# Altium project Battery Protector.PrjPcb
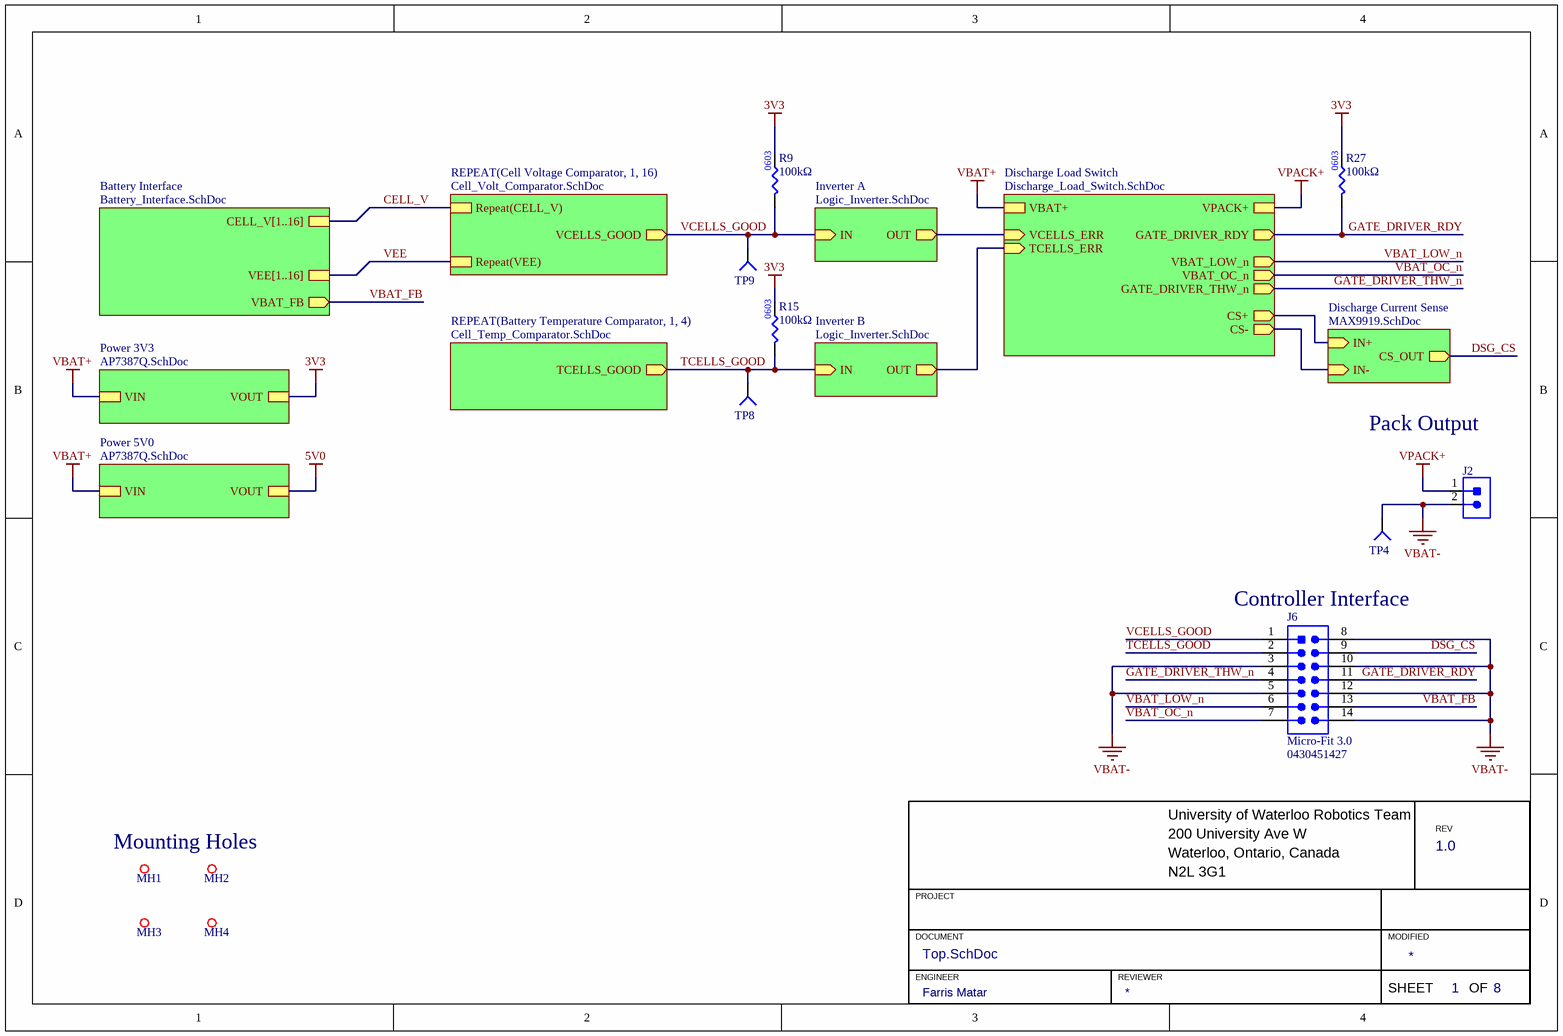
[diagram p0: Top.SchDoc]
Revision: 1.0; Engineer: Farris Matar
8 sheets, 434 parts. Net scope: hierarchical (ports join the sheet entries above them; power ports are global).
Board file: Battery Protector.PcbDoc
Sheets:
  Top.SchDoc
    Cell Voltage Comparator1 = Cell_Volt_Comparator.SchDoc
    Cell Voltage Comparator2 = Cell_Volt_Comparator.SchDoc
    Cell Voltage Comparator3 = Cell_Volt_Comparator.SchDoc
    Cell Voltage Comparator4 = Cell_Volt_Comparator.SchDoc
    Cell Voltage Comparator5 = Cell_Volt_Comparator.SchDoc
    Cell Voltage Comparator6 = Cell_Volt_Comparator.SchDoc
    Cell Voltage Comparator7 = Cell_Volt_Comparator.SchDoc
    Cell Voltage Comparator8 = Cell_Volt_Comparator.SchDoc
    Cell Voltage Comparator9 = Cell_Volt_Comparator.SchDoc
    Cell Voltage Comparator10 = Cell_Volt_Comparator.SchDoc
    Cell Voltage Comparator11 = Cell_Volt_Comparator.SchDoc
    Cell Voltage Comparator12 = Cell_Volt_Comparator.SchDoc
    Cell Voltage Comparator13 = Cell_Volt_Comparator.SchDoc
    Cell Voltage Comparator14 = Cell_Volt_Comparator.SchDoc
    Cell Voltage Comparator15 = Cell_Volt_Comparator.SchDoc
    Cell Voltage Comparator16 = Cell_Volt_Comparator.SchDoc
    Battery Interface = Battery_Interface.SchDoc
    Battery Temperature Comparator1 = Cell_Temp_Comparator.SchDoc
    Battery Temperature Comparator2 = Cell_Temp_Comparator.SchDoc
    Battery Temperature Comparator3 = Cell_Temp_Comparator.SchDoc
    Battery Temperature Comparator4 = Cell_Temp_Comparator.SchDoc
    Power 3V3 = AP7387Q.SchDoc
    Discharge Load Switch = Discharge_Load_Switch.SchDoc
    Inverter B = Logic_Inverter.SchDoc
    Inverter A = Logic_Inverter.SchDoc
    Discharge Current Sense = MAX9919.SchDoc
    Power 5V0 = AP7387Q.SchDoc

## Sheet Top.SchDoc
size A4; Engineer: Farris Matar; Organization: TESLA Motors, INC; Address1: 3500 Deer Creek Road; Address2: Palo Alto, CA; Address4: U.S.A.; SheetNumber: 1; SheetTotal: 8

### Parts
J2  CON_2POS_XT90  [XT90]  (value not drawn)
J6  Family: Micro-Fit 3.0  [MOLEX-0430451427]  (hidden comment: 0430451427)
MH1  MOUNTING_HOLE_M3  [MOUNTING_HOLE_3mm]  (value not drawn)  (no BOM)
MH2  MOUNTING_HOLE_M3  [MOUNTING_HOLE_3mm]  (value not drawn)  (no BOM)
MH3  MOUNTING_HOLE_M3  [MOUNTING_HOLE_3mm]  (value not drawn)  (no BOM)
MH4  MOUNTING_HOLE_M3  [MOUNTING_HOLE_3mm]  (value not drawn)  (no BOM)
R9  value 100kΩ  [RES0603]  (hidden comment: RES_100kΩ_0603_1%)
R15  value 100kΩ  [RES0603]  (hidden comment: RES_100kΩ_0603_1%)
R27  value 100kΩ  [RES0603]  (hidden comment: RES_100kΩ_0603_1%)
TP4  TESTPOINT_SMD_LOOP  [S1751-46R]  (value not drawn)
TP8  TESTPOINT_1MM_CIRCLE  [TESTPOINT_CIRCLE_1MM]  (value not drawn)  (no BOM)
TP9  TESTPOINT_1MM_CIRCLE  [TESTPOINT_CIRCLE_1MM]  (value not drawn)  (no BOM)

### Sub-sheets
Battery Interface = Battery_Interface.SchDoc: CELL_V[1..16], VEE[1..16], VBAT_FB (out)
Discharge Current Sense = MAX9919.SchDoc: IN+ (in), IN- (in), CS_OUT (out)
Discharge Load Switch = Discharge_Load_Switch.SchDoc: VBAT+, VPACK+, VCELLS_ERR (in), TCELLS_ERR (in), VBAT_LOW_n (out), VBAT_OC_n (out), GATE_DRIVER_THW_n (out), GATE_DRIVER_RDY (out), CS+ (out), CS- (out)
Inverter A = Logic_Inverter.SchDoc: IN (in), OUT (out)
Inverter B = Logic_Inverter.SchDoc: IN (in), OUT (out)
Power 3V3 = AP7387Q.SchDoc: VIN, VOUT
Power 5V0 = AP7387Q.SchDoc: VIN, VOUT
REPEAT(Battery Temperature Comparator, 1, 4) = Cell_Temp_Comparator.SchDoc: TCELLS_GOOD (out)
REPEAT(Cell Voltage Comparator, 1, 16) = Cell_Volt_Comparator.SchDoc: Repeat(CELL_V), Repeat(VEE), VCELLS_GOOD (out)

### Nets
3V3: R9.2 R15.2 R27.2 ; sheet Power 3V3/VOUT
VBAT+: sheet Power 3V3/VIN, sheet Discharge Load Switch/VBAT+, sheet Discharge Load Switch/CS+, sheet Discharge Current Sense/IN+, sheet Power 5V0/VIN
VBAT-: J2.2 J6.3 J6.5 J6.8 J6.10 J6.12 J6.14 TP4.1(=value)
VPACK+: J2.1 ; sheet Discharge Load Switch/VPACK+
CELL_V: sheet REPEAT(Cell Voltage Comparator, 1, 16)/Repeat(CELL_V)
CS-: sheet Discharge Load Switch/CS-, sheet Discharge Current Sense/IN-
DSG_CS: J6.9 ; sheet Discharge Current Sense/CS_OUT
GATE_DRIVER_RDY: J6.11 R27.1 ; sheet Discharge Load Switch/GATE_DRIVER_RDY
GATE_DRIVER_THW_n: J6.4 ; sheet Discharge Load Switch/GATE_DRIVER_THW_n
TCELLS_ERR: sheet Discharge Load Switch/TCELLS_ERR, sheet Inverter B/OUT
TCELLS_GOOD: J6.2 R15.1 TP8.1(=value) ; sheet REPEAT(Battery Temperature Comparator, 1, 4)/TCELLS_GOOD, sheet Inverter B/IN  [project net CT_GD]
VBAT_FB: J6.13 ; sheet Battery Interface/VBAT_FB
VBAT_LOW_n: J6.6 ; sheet Discharge Load Switch/VBAT_LOW_n
VBAT_OC_n: J6.7 ; sheet Discharge Load Switch/VBAT_OC_n
VCELLS_ERR: sheet Discharge Load Switch/VCELLS_ERR, sheet Inverter A/OUT
VCELLS_GOOD: J6.1 R9.1 TP9.1(=value) ; sheet REPEAT(Cell Voltage Comparator, 1, 16)/VCELLS_GOOD, sheet Inverter A/IN
VEE: sheet REPEAT(Cell Voltage Comparator, 1, 16)/Repeat(VEE)

### Notes on the sheet
- Pack Output
- (near J6) Controller Interface
- Mounting Holes
- University of Waterloo Robotics Team
- 200 University Ave W
- REV
- PROJECT
- Waterloo, Ontario, Canada
- N2L 3G1
- DOCUMENT
- ENGINEER
- REVIEWER
- MODIFIED
- SHEET
- OF
- (in symbol RES_100kΩ_0603_1%) 0603

### Library data of the parts
J2 = CON_2POS_XT90: HIGH QUALITY GOLD PLATED XT90 MA; Manufacturer 1: DFRobot; Manufacturer Part Number 1: FIT0588; Mounting Type: TH; Package/Footprint: XT90; Supplier 1: Digi-Key; Supplier Part Number 1: 1738-1438-ND
J6 = CON_MOLEX-HDR_7x2_TH: CONN HEADER VERT 14POS 3MM; Manufacturer 1: Molex; Voltage Rating: 250VAC; Current Rating: 5A; Pitch: 3mm; Supplier 1: Digi-Key; Supplier Part Number 1: WM10707-ND; Manufacturer Part Number 1: 0430451427
R9 R15 R27 = RES_100kΩ_0603_1%: RES 100K OHM 1% 1/10W 0603; Manufacturer 1: Yageo; Manufacturer Part Number 1: RC0603FR-07100KL; Supplier Part Number 1: 311-100KHRCT-ND; Supplier 1: Digi-Key
TP4 = TESTPOINT_SMD_LOOP: TESTPOINT SMD LOOP; Manufacturer 1: Harwin; Supplier 1: Digi-Key; Manufacturer Part Number 1: S1751-46R; Mounting Type: SMD; Package/Footprint: SMD; Supplier Part Number 1: 952-1478-1-ND
TP8 TP9 = TESTPOINT_1MM_CIRCLE: TESTPOINT 1MM CIRCLE

## Sheet Cell_Volt_Comparator.SchDoc
size A4; Engineer: Farris Matar; Organization: TESLA Motors, INC; Address1: 3500 Deer Creek Road; Address2: Palo Alto, CA; Address4: U.S.A.; SheetNumber: 4; SheetTotal: 8
Used 16 times, as channels Cell Voltage Comparator1, Cell Voltage Comparator2, Cell Voltage Comparator3, Cell Voltage Comparator4, Cell Voltage Comparator5, Cell Voltage Comparator6, Cell Voltage Comparator7, Cell Voltage Comparator8, Cell Voltage Comparator9, Cell Voltage Comparator10, Cell Voltage Comparator11, Cell Voltage Comparator12, Cell Voltage Comparator13, Cell Voltage Comparator14, Cell Voltage Comparator15, Cell Voltage Comparator16. Parts and nets are listed once, with the designators drawn on the sheet.
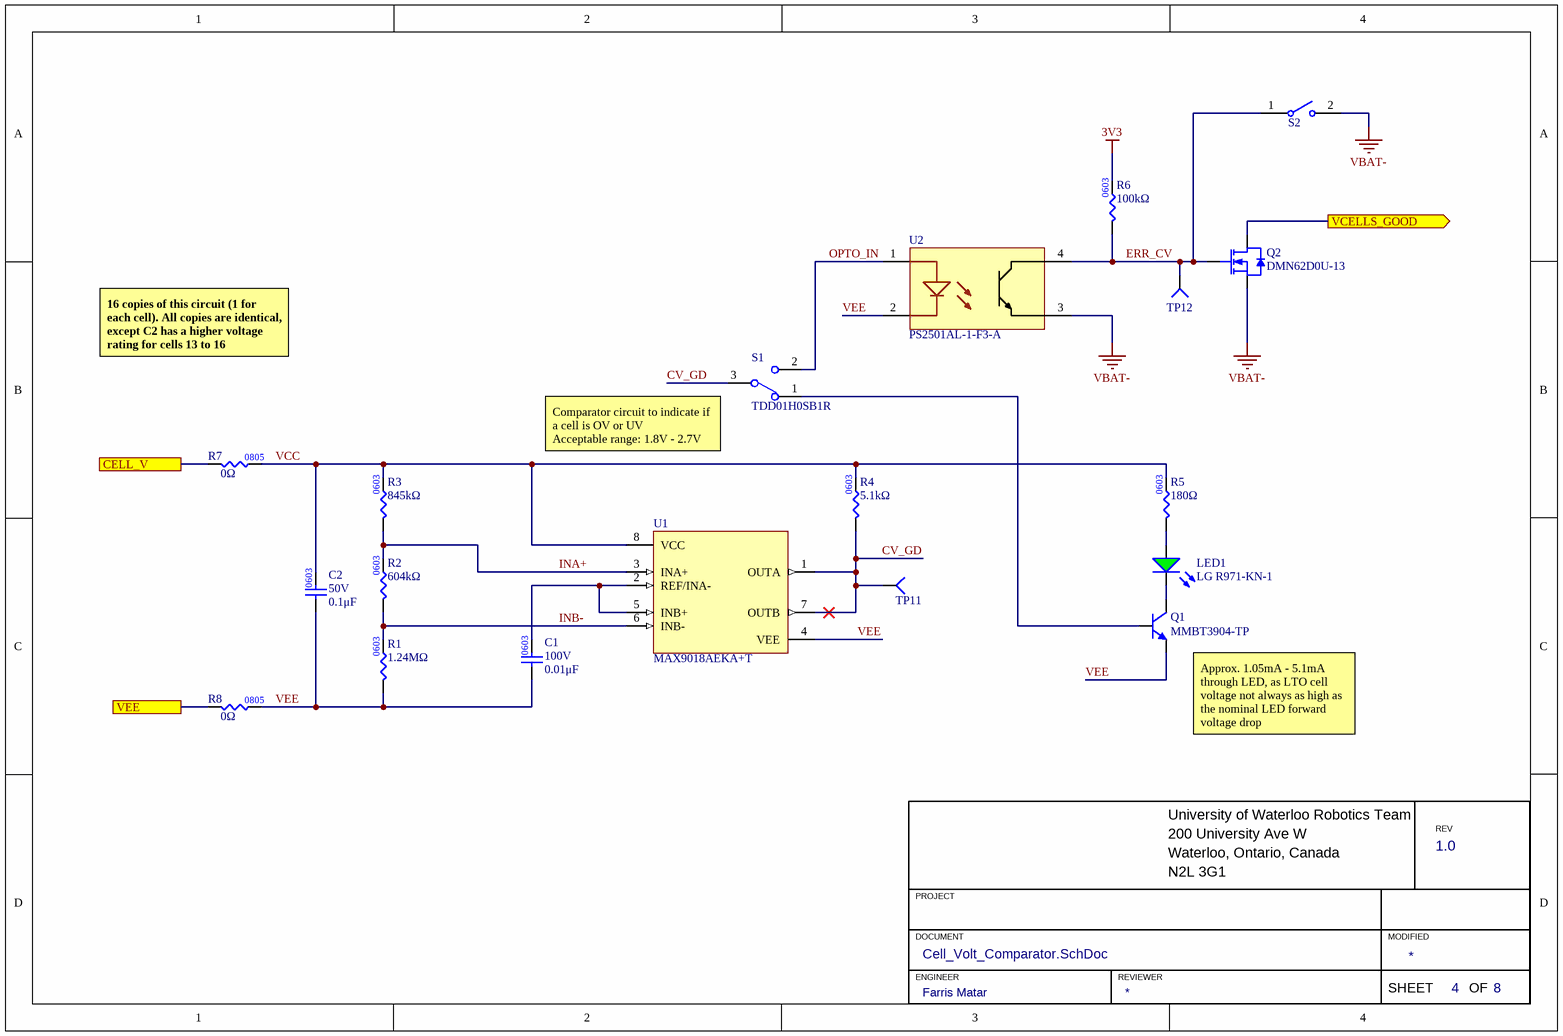
[diagram p1: Cell_Volt_Comparator.SchDoc]

### Parts
C1  value 0.01μF  Voltage Rating: 100V  [CAP0603]  (hidden comment: CAP_0.01uF_100V_0603)
C2  value 0.1μF  Voltage Rating: 50V  [CAP0603]  (hidden comment: CAP_0.1uF_50V_0603)
LED1  Manufacturer Part Number 1: LG R971-KN-1  [LED_0805_GREEN]  (hidden comment: LED_GREEN)
Q1  Manufacturer Part Number 1: MMBT3904-TP  [SOT23-3]  (hidden comment: NPN_40V_100mA)
Q2  Manufacturer Part Number 1: DMN62D0U-13  [NMOS_SSOT-3]  (hidden comment: NMOS_60V_380mA)
R1  value 1.24MΩ  [RES0603]  (hidden comment: RES_1.24MΩ_0603_1%)
R2  value 604kΩ  [RES0603]  (hidden comment: RES_604kΩ_0603_1%)
R3  value 845kΩ  [RES0603]  (hidden comment: RES_845kΩ_0603_1%)
R4  value 5.1kΩ  [RES0603]  (hidden comment: RES_5.1kΩ_0603_1%)
R5  value 180Ω  [RES0603]  (hidden comment: RES_180Ω_0603_1%)
R6  value 100kΩ  [RES0603]  (hidden comment: RES_100kΩ_0603_1%)
R7  value 0Ω  [RES0805]  (hidden comment: RES_0Ω_0805)
R8  value 0Ω  [RES0805]  (hidden comment: RES_0Ω_0805)
S1  Manufacturer Part Number 1: TDD01H0SB1R  [TDD01_SPDT]  (hidden comment: SW_SLIDE_SPDT_SMD)
S2  SW_SLIDE_SPST_SMD  [SDA01_SPST]  (value not drawn)
TP11  TESTPOINT_1MM_CIRCLE  [TESTPOINT_CIRCLE_1MM]  (value not drawn)  (no BOM)
TP12  TESTPOINT_1MM_CIRCLE  [TESTPOINT_CIRCLE_1MM]  (value not drawn)  (no BOM)
U1  Manufacturer Part Number 1: MAX9018AEKA+T  [SOT23-8 MAXIM]  (hidden comment: IC_COMPARATOR_MAX9018)
U2  Manufacturer Part Number 1: PS2501AL-1-F3-A  [DIP-4L_REN]  (hidden comment: OPTOCOUPLER_PS2501AL-1-F3-A)

### Ports
CELL_V, VCELLS_GOOD (out), VEE

### Nets
3V3: R6.2
VBAT-: Q2.2(SOURCE) S2.2 U2.3(Emitter)
CELL_V: R7.1 ; port CELL_V
CV_GD: R4.1 S1.3 TP11.1(=value) U1.1(OUTA) U1.7(OUTB)
ERR_CV: Q2.1(GATE) R6.1 S2.1 TP12.1(=value) U2.4(Collector)
INA+: R2.2 R3.1 U1.3(INA+)
INB-: R1.2 R2.1 U1.6(INB-)
OPTO_IN: S1.2 U2.1(Anode)
VCC: C2.2 R3.2 R4.2 R5.2 R7.2 U1.8(VCC)
VCELLS_GOOD: Q2.3(DRAIN) ; port VCELLS_GOOD
VEE: C1.1 C2.1 Q1.2(E) R1.1 R8.2 U1.4(VEE) U2.2(Cathode)
VEE: R8.1 ; port VEE  [a separate net that carries the same name]
NetC1_2: C1.2 U1.2(REF/INA-) U1.5(INB+)
NetLED1_1: LED1.1(A) R5.1
NetLED1_2: LED1.2(K) Q1.3(C)
NetQ1_1: Q1.1(B) S1.1

### Channels
Cell Voltage Comparator1: designators end in A; ports CELL_V=CELL_V1 VCELLS_GOOD=VCELLS_GOOD VEE=VEE1
Cell Voltage Comparator2: designators end in B; ports CELL_V=CELL_V2 VCELLS_GOOD=VCELLS_GOOD VEE=VEE2
Cell Voltage Comparator3: designators end in C; ports CELL_V=CELL_V3 VCELLS_GOOD=VCELLS_GOOD VEE=VEE3
Cell Voltage Comparator4: designators end in D; ports CELL_V=CELL_V4 VCELLS_GOOD=VCELLS_GOOD VEE=VEE4
Cell Voltage Comparator5: designators end in E; ports CELL_V=CELL_V5 VCELLS_GOOD=VCELLS_GOOD VEE=VEE5
Cell Voltage Comparator6: designators end in F; ports CELL_V=CELL_V6 VCELLS_GOOD=VCELLS_GOOD VEE=VEE6
Cell Voltage Comparator7: designators end in G; ports CELL_V=CELL_V7 VCELLS_GOOD=VCELLS_GOOD VEE=VEE7
Cell Voltage Comparator8: designators end in H; ports CELL_V=CELL_V8 VCELLS_GOOD=VCELLS_GOOD VEE=VEE8
Cell Voltage Comparator9: designators end in I; ports CELL_V=CELL_V9 VCELLS_GOOD=VCELLS_GOOD VEE=VEE9
Cell Voltage Comparator10: designators end in J; ports CELL_V=CELL_V10 VCELLS_GOOD=VCELLS_GOOD VEE=VEE10
Cell Voltage Comparator11: designators end in K; ports CELL_V=CELL_V11 VCELLS_GOOD=VCELLS_GOOD VEE=VEE11
Cell Voltage Comparator12: designators end in L; ports CELL_V=CELL_V12 VCELLS_GOOD=VCELLS_GOOD VEE=VEE12
Cell Voltage Comparator13: designators end in M; ports CELL_V=CELL_V13 VCELLS_GOOD=VCELLS_GOOD VEE=VEE13
Cell Voltage Comparator14: designators end in N; ports CELL_V=CELL_V14 VCELLS_GOOD=VCELLS_GOOD VEE=VEE14
Cell Voltage Comparator15: designators end in O; ports CELL_V=CELL_V15 VCELLS_GOOD=VCELLS_GOOD VEE=VEE15
Cell Voltage Comparator16: designators end in P; ports CELL_V=CELL_V16 VCELLS_GOOD=VCELLS_GOOD VEE=VEE16

### Notes on the sheet
- 16 copies of this circuit (1 for each cell). All copies are identical, except C2 has a higher voltage rating for cells 13 to 16
- (near S1) Comparator circuit to indicate if a cell is OV or UV
  Acceptable range: 1.8V - 2.7V
- (near Q1) Approx. 1.05mA - 5.1mA through LED, as LTO cell voltage not always as high as the nominal LED forward voltage drop
- University of Waterloo Robotics Team
- 200 University Ave W
- REV
- PROJECT
- Waterloo, Ontario, Canada
- N2L 3G1
- DOCUMENT
- ENGINEER
- REVIEWER
- MODIFIED
- SHEET
- OF
- (in symbol CAP_0.01uF_100V_0603) 0603
- (in symbol RES_100kΩ_0603_1%) 0603
- (in symbol RES_180Ω_0603_1%) 0603
- (in symbol RES_604kΩ_0603_1%) 0603
- (in symbol RES_845kΩ_0603_1%) 0603

### Library data of the parts
C1 = CAP_0.01uF_100V_0603: CAP CER 0.01uF 100V X7R 0603; Manufacturer Part Number 1: GCM188R72A103KA37J; Manufacturer 1: Murata Electronics; Supplier Part Number 1: 490-8028-1-ND; Supplier 1: Digi-Key; Dielectric: X7R
C2 = CAP_0.1uF_50V_0603: CAP CER 0.1UF 50V X7R 0603; Manufacturer Part Number 1: CC0603KRX7R9BB104; Manufacturer 1: Yageo; Package/Footprint: 0603; Supplier Part Number 1: 311-1344-1-ND; Supplier 1: Digi-Key; Mounting Type: SMD; Dielectric: X7R
LED1 = LED_GREEN: LED GREEN DIFFUSED 0805 SMD; Manufacturer 1: OSRAM; Forward Voltage Drop: 2.2V; Package/Footprint: 0805; Supplier Part Number 1: 475-1410-1-ND; Supplier 1: Digi-Key; Mounting Type: SMD
Q1 = NPN_40V_100mA: TRANS NPN 40V 0.2A SOT23; Manufacturer 1: Micro Commercial Co; Package: SOT-23-3; Supplier Part Number 1: MMBT3904TPMSCT-ND; Supplier 1: Digi-Key
Q2 = NMOS_60V_380mA: MOSFET N-CH 60V 380MA SOT23; Manufacturer 1: Diodes Incorporated; Vgs (Max): ±12V; Supplier 1: Digi-Key; Mounting Type: SMD; Package: SOT-23-3; Supplier Part Number 1: DMN62D0U-13DICT-ND; Id: 380mA; Vdss: 60V
R1 = RES_1.24MΩ_0603_1%: RES 1.24M OHM 1% 1/16W 0402; Manufacturer 1: Stackpole Electronics Inc; Manufacturer Part Number 1: RMCF0402FT1M24; Package: 0603; Supplier 1: Digi-Key; Supplier Part Number 1: RMCF0402FT1M24CT-ND
R2 = RES_604kΩ_0603_1%: RES 604K OHM 1% 1/10W 0603; Manufacturer 1: Yageo; Manufacturer Part Number 1: RC0603FR-07604KL; Supplier Part Number 1: 311-604KHRCT-ND; Supplier 1: Digi-Key
R3 = RES_845kΩ_0603_1%: RES 845K OHM 1% 1/10W 0603; Manufacturer 1: Yageo; Manufacturer Part Number 1: RC0603FR-07845KL; Supplier Part Number 1: 311-845KHRCT-ND; Supplier 1: Digi-Key
R4 = RES_5.1kΩ_0603_1%: RES 5.1K OHM 1% 1/10W 0603; Manufacturer 1: YAGEO; Manufacturer Part Number 1: RC0603FR-135K1L; Supplier Part Number 1: 13-RC0603FR-135K1LCT-ND; Supplier 1: Digi-Key; Mounting Type: SMD; Package: 0603
R5 = RES_180Ω_0603_1%: RES 180 OHM 1% 1/10W 0603; Manufacturer 1: Yageo; Manufacturer Part Number 1: RC0603FR-13180RL; Supplier Part Number 1: 13-RC0603FR-13180RLCT-ND; Supplier 1: Digi-Key
R6 = RES_100kΩ_0603_1%: as R9 on sheet Top; Supplier Part Number 1: 311-100KHRCT-ND; Supplier 1: Digi-Key
R7 R8 = RES_0Ω_0805: RES SMD 0 OHM JUMPER 1/2W 0805 (20A RATED); Manufacturer 1: Keystone Electronics; Manufacturer Part Number 1: 5106; Package/Footprint: 0805; Supplier Part Number 1: 36-5106CT-ND; Supplier 1: Digi-Key; Mounting Type: SMD
S1 = SW_SLIDE_SPDT_SMD: SWITCH SLIDE DIP SPDT 25MA 24V; Manufacturer 1: C&K; Voltage Rating: 24VDC; Supplier 1: Digi-Key; Supplier Part Number 1: CKN10546CT-ND
S2 = SW_SLIDE_SPST_SMD: SWITCH SLIDE DIP SPST 25MA 24V; Manufacturer 1: C&K; Manufacturer Part Number 1: SDA01H0SB; Voltage Rating: 24VDC; Supplier 1: Digi-Key; Supplier Part Number 1: CKN10914-ND
TP11 TP12 = TESTPOINT_1MM_CIRCLE: TESTPOINT 1MM CIRCLE
U1 = IC_COMPARATOR_MAX9018: IC COMPARATOR DUAL SOT23-8; Manufacturer 1: Analog Devices Inc./Maxim Integrated; Package/Footprint: SOT-23-8; Mounting Type: SMD; Supplier 1: Digi-Key; Supplier Part Number 1: MAX9018AEKA+TCT-ND
U2 = OPTOCOUPLER_PS2501AL-1-F3-A: OPTOISOLATOR 5KV TRANS 4SMD; Manufacturer 1: Renesas Electronics America Inc; Supplier 1: Digi-Key; Supplier Part Number 1: 559-1074-1-ND

## Sheet Battery_Interface.SchDoc
size A4; Engineer: Farris Matar; Organization: TESLA Motors, INC; Address1: 3500 Deer Creek Road; Address2: Palo Alto, CA; Address4: U.S.A.; SheetNumber: 2; SheetTotal: 8
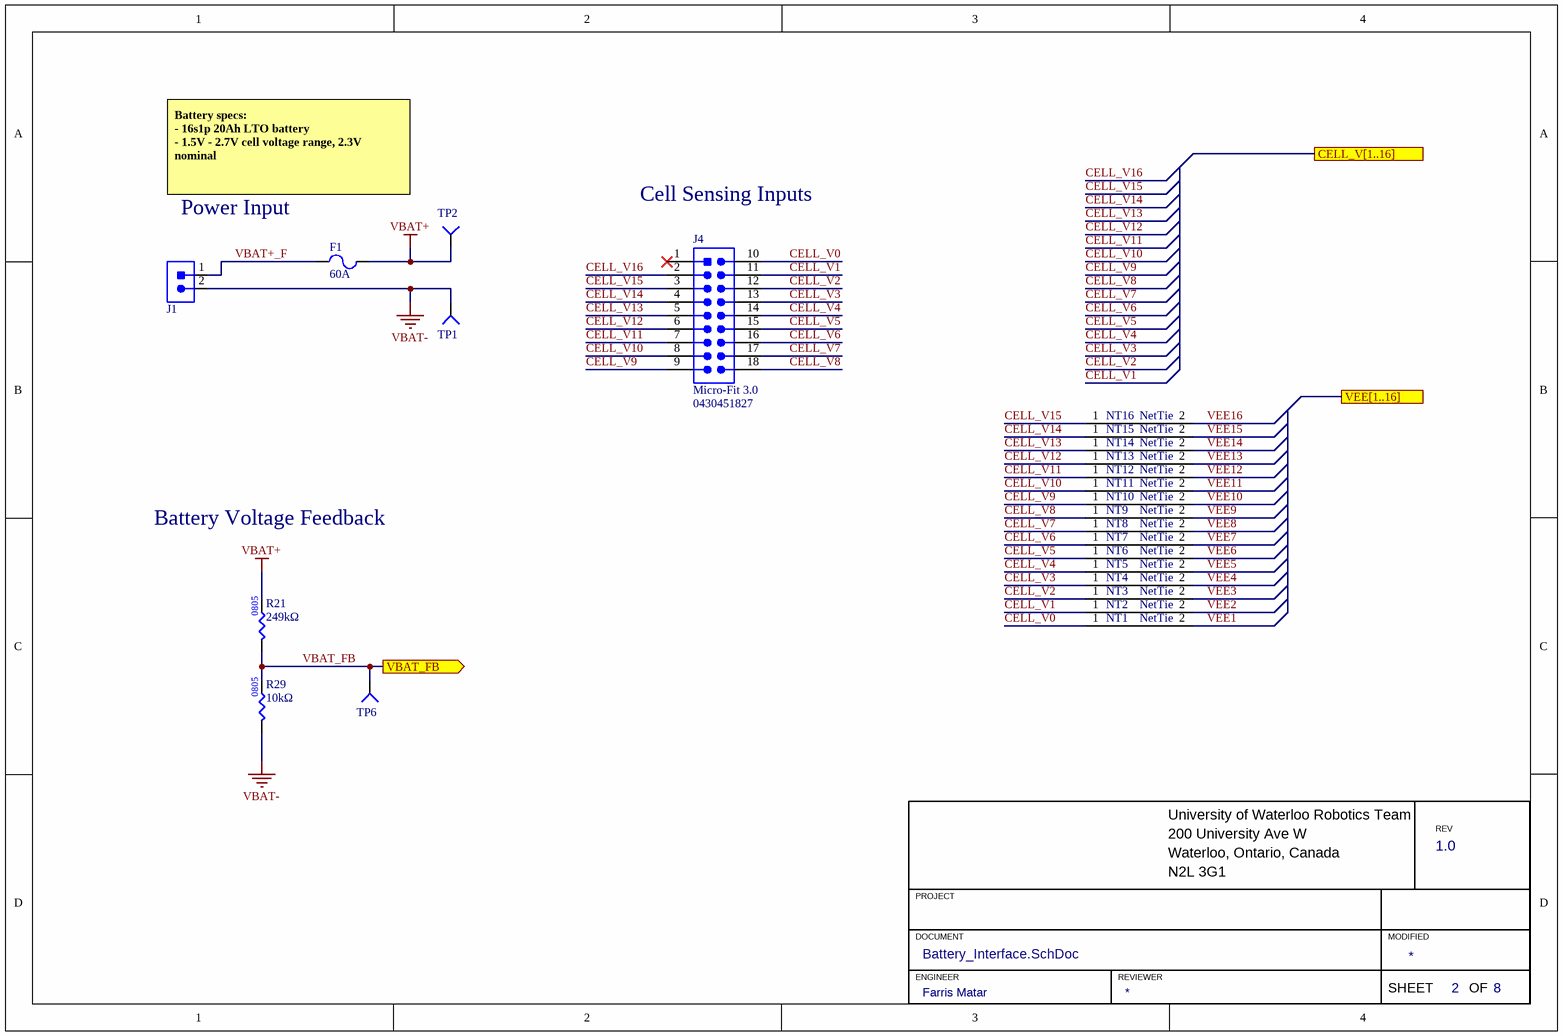
[diagram p2: Battery_Interface.SchDoc]

### Parts
F1  Current Rating: 60A  [FUSE_3812_BOURNS]  (hidden comment: FUSE_60A_3812)
J1  CON_2POS_XT90  [XT90]  (value not drawn)
J4  Family: Micro-Fit 3.0  [MOLEX-0430451827]  (hidden comment: 0430451827)
NT1  NetTie  [NET_TIE]  (value not drawn)
NT2  NetTie  [NET_TIE]  (value not drawn)
NT3  NetTie  [NET_TIE]  (value not drawn)
NT4  NetTie  [NET_TIE]  (value not drawn)
NT5  NetTie  [NET_TIE]  (value not drawn)
NT6  NetTie  [NET_TIE]  (value not drawn)
NT7  NetTie  [NET_TIE]  (value not drawn)
NT8  NetTie  [NET_TIE]  (value not drawn)
NT9  NetTie  [NET_TIE]  (value not drawn)
NT10  NetTie  [NET_TIE]  (value not drawn)
NT11  NetTie  [NET_TIE]  (value not drawn)
NT12  NetTie  [NET_TIE]  (value not drawn)
NT13  NetTie  [NET_TIE]  (value not drawn)
NT14  NetTie  [NET_TIE]  (value not drawn)
NT15  NetTie  [NET_TIE]  (value not drawn)
NT16  NetTie  [NET_TIE]  (value not drawn)
R21  value 249kΩ  [RES0805]  (hidden comment: RES_249kΩ_0805_1%)
R29  value 10kΩ  [RES0805]  (hidden comment: RES_10kΩ_0805_5%)
TP1  TESTPOINT_SMD_LOOP  [S1751-46R]  (value not drawn)
TP2  TESTPOINT_SMD_LOOP  [S1751-46R]  (value not drawn)
TP6  TESTPOINT_1MM_CIRCLE  [TESTPOINT_CIRCLE_1MM]  (value not drawn)  (no BOM)

### Ports
CELL_V[1..16], VBAT_FB (out), VEE[1..16]

### Nets
VBAT+: F1.2 R21.2 TP2.1(=value)
VBAT-: J1.2 R29.1 TP1.1(=value)
CELL_V0: J4.10 NT1.1
CELL_V1: J4.11 NT2.1
CELL_V2: J4.12 NT3.1
CELL_V3: J4.13 NT4.1
CELL_V4: J4.14 NT5.1
CELL_V5: J4.15 NT6.1
CELL_V6: J4.16 NT7.1
CELL_V7: J4.17 NT8.1
CELL_V8: J4.18 NT9.1
CELL_V9: J4.9 NT10.1
CELL_V10: J4.8 NT11.1
CELL_V11: J4.7 NT12.1
CELL_V12: J4.6 NT13.1
CELL_V13: J4.5 NT14.1
CELL_V14: J4.4 NT15.1
CELL_V15: J4.3 NT16.1
CELL_V16: J4.2
VBAT+_F: F1.1 J1.1
VBAT_FB: R21.1 R29.2 TP6.1(=value) ; port VBAT_FB
VEE1: NT1.2
VEE2: NT2.2
VEE3: NT3.2
VEE4: NT4.2
VEE5: NT5.2
VEE6: NT6.2
VEE7: NT7.2
VEE8: NT8.2
VEE9: NT9.2
VEE10: NT10.2
VEE11: NT11.2
VEE12: NT12.2
VEE13: NT13.2
VEE14: NT14.2
VEE15: NT15.2
VEE16: NT16.2

Not connected (* = marked no-connect by the designer): J4 1*

### Notes on the sheet
- Battery specs:
  - 16s1p 20Ah LTO battery
  - 1.5V - 2.7V cell voltage range, 2.3V nominal
- Power Input
- Cell Sensing Inputs
- Battery Voltage Feedback
- University of Waterloo Robotics Team
- 200 University Ave W
- REV
- PROJECT
- Waterloo, Ontario, Canada
- N2L 3G1
- DOCUMENT
- ENGINEER
- REVIEWER
- MODIFIED
- SHEET
- OF

### Library data of the parts
F1 = FUSE_60A_3812: FUSE BRD 60A 250VAC 100VDC 2SMD; Manufacturer 1: Bourns Inc.; Manufacturer Part Number 1: SF-3812F6000T-2; Package/Footprint: 3812; Mounting Type: SMD; Verified: No; Supplier 1: Digi-Key; Supplier Part Number 1: 118-SF-3812F6000T-2CT-ND
J1 = CON_2POS_XT90: as J2 on sheet Top; Mounting Type: TH; Package/Footprint: XT90; Supplier 1: Digi-Key; Supplier Part Number 1: 1738-1438-ND
J4 = CON_MOLEX-HDR_9x2_TH: CONN HEADER VERT 18POS 3MM; Manufacturer 1: Molex; Voltage Rating: 250VAC; Current Rating: 5A; Pitch: 3mm; Supplier 1: Digi-Key; Supplier Part Number 1: WM10723-ND; Manufacturer Part Number 1: 0430451827
R21 = RES_249kΩ_0805_1%: RES 249K OHM 1% 1/8W 0805; Manufacturer 1: Yageo; Manufacturer Part Number 1: RC0805FR-07249KL; Package/Footprint: 0805; Supplier Part Number 1: 311-249KCRCT-ND; Supplier 1: Digi-Key; Mounting Type: SMD; LCSC Part #: C25825
R29 = RES_10kΩ_0805_5%: RES 10K OHM 5% 1/8W 0805; Manufacturer 1: Panasonic Electronic Components; Manufacturer Part Number 1: ERJ-6GEYJ103V; Package/Footprint: 0805; Supplier 1: Digi-Key; Supplier Part Number 1: P10KACT-ND; LCSC Part #: C17414; Mounting Type: SMD
TP1 TP2 = TESTPOINT_SMD_LOOP: as TP4 on sheet Top; Supplier 1: Digi-Key; Manufacturer Part Number 1: S1751-46R; Mounting Type: SMD; Package/Footprint: SMD; Supplier Part Number 1: 952-1478-1-ND
TP6 = TESTPOINT_1MM_CIRCLE: TESTPOINT 1MM CIRCLE

## Sheet Cell_Temp_Comparator.SchDoc
size A4; Engineer: Farris Matar; Organization: TESLA Motors, INC; Address1: 3500 Deer Creek Road; Address2: Palo Alto, CA; Address4: U.S.A.; SheetNumber: 3; SheetTotal: 8
Used 4 times, as channels Battery Temperature Comparator1, Battery Temperature Comparator2, Battery Temperature Comparator3, Battery Temperature Comparator4. Parts and nets are listed once, with the designators drawn on the sheet.
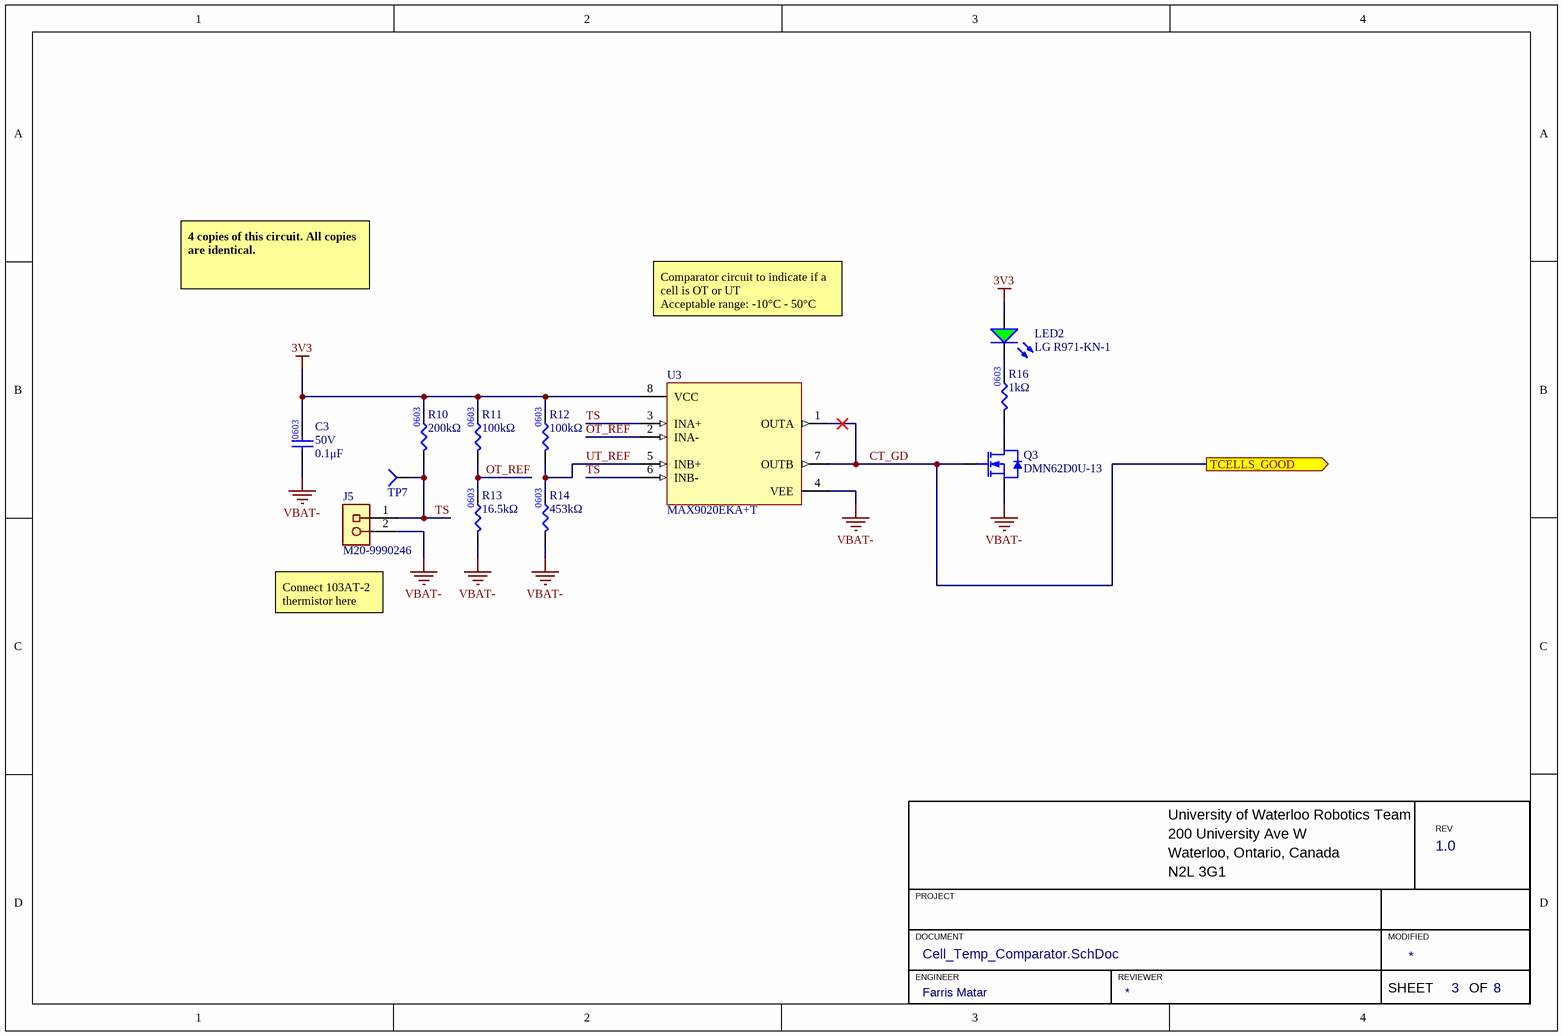
[diagram p3: Cell_Temp_Comparator.SchDoc]

### Parts
C3  value 0.1μF  Voltage Rating: 50V  [CAP0603]  (hidden comment: CAP_0.1uF_50V_0603)
J5  Manufacturer Part Number 1: M20-9990246  [HDR1X2]  (hidden comment: HEADER 2x1)
LED2  Manufacturer Part Number 1: LG R971-KN-1  [LED_0805_GREEN]  (hidden comment: LED_GREEN)
Q3  Manufacturer Part Number 1: DMN62D0U-13  [NMOS_SSOT-3]  (hidden comment: NMOS_60V_380mA)
R10  value 200kΩ  [RES0603]  (hidden comment: RES_200kΩ_0603_1%)
R11  value 100kΩ  [RES0603]  (hidden comment: RES_100kΩ_0603_1%)
R12  value 100kΩ  [RES0603]  (hidden comment: RES_100kΩ_0603_1%)
R13  value 16.5kΩ  [RES0603]  (hidden comment: RES_16.5kΩ_0603_1%)
R14  value 453kΩ  [RES0603]  (hidden comment: RES_453kΩ_0603_1%)
R16  value 1kΩ  [RES0603]  (hidden comment: RES_1kΩ_0603_1%)
TP7  TESTPOINT_1MM_CIRCLE  [TESTPOINT_CIRCLE_1MM]  (value not drawn)  (no BOM)
U3  Manufacturer Part Number 1: MAX9020EKA+T  [SOT23-8 MAXIM]  (hidden comment: IC_COMPARATOR_MAX9020)

### Ports
TCELLS_GOOD (out)

### Nets
3V3: C3.2 LED2.1(A) R10.2 R11.2 R12.2 U3.8(VCC)
VBAT-: C3.1 J5.2 Q3.2(SOURCE) R13.1 R14.1 U3.4(VEE)
CT_GD: Q3.1(GATE) U3.1(OUTA) U3.7(OUTB) ; port TCELLS_GOOD
OT_REF: R11.1 R13.2 U3.2(INA-)
TS: J5.1(VCC) R10.1 TP7.1(=value) U3.3(INA+) U3.6(INB-)
UT_REF: R12.1 R14.2 U3.5(INB+)
NetLED2_2: LED2.2(K) R16.2
NetQ3_3: Q3.3(DRAIN) R16.1

### Channels
Battery Temperature Comparator1: designators end in A; ports TCELLS_GOOD=CT_GD
Battery Temperature Comparator2: designators end in B; ports TCELLS_GOOD=CT_GD
Battery Temperature Comparator3: designators end in C; ports TCELLS_GOOD=CT_GD
Battery Temperature Comparator4: designators end in D; ports TCELLS_GOOD=CT_GD

### Notes on the sheet
- 4 copies of this circuit. All copies are identical.
- Comparator circuit to indicate if a cell is OT or UT
  Acceptable range: -10°C - 50°C
- (near J5) Connect 103AT-2 thermistor here
- University of Waterloo Robotics Team
- 200 University Ave W
- REV
- PROJECT
- Waterloo, Ontario, Canada
- N2L 3G1
- DOCUMENT
- ENGINEER
- REVIEWER
- MODIFIED
- SHEET
- OF
- (in symbol RES_16.5kΩ_0603_1%) 0603
- (in symbol RES_100kΩ_0603_1%) 0603

### Library data of the parts
C3 = CAP_0.1uF_50V_0603: as C2 on sheet Cell_Volt_Comparator; Supplier Part Number 1: 311-1344-1-ND; Supplier 1: Digi-Key; Mounting Type: SMD; Dielectric: X7R
J5 = HEADER 2x1: Manufacturer 1: Harwin Inc.; Package/Footprint: TH; Mounting Type: TH; Supplier 1: Digi-Key; Supplier Part Number 1: 952-2262-ND
LED2 = LED_GREEN: as LED1 on sheet Cell_Volt_Comparator; Supplier Part Number 1: 475-1410-1-ND; Supplier 1: Digi-Key; Mounting Type: SMD
Q3 = NMOS_60V_380mA: as Q2 on sheet Cell_Volt_Comparator; Supplier 1: Digi-Key; Mounting Type: SMD; Package: SOT-23-3; Supplier Part Number 1: DMN62D0U-13DICT-ND; Id: 380mA; Vdss: 60V
R10 = RES_200kΩ_0603_1%: RES 200K OHM 1% 1/10W 0603; Manufacturer 1: YAGEO; Manufacturer Part Number 1: RC0603FR-13200KL; Package/Footprint: 0603; Supplier Part Number 1: 13-RC0603FR-13200KLCT-ND; Supplier 1: Digi-Key; Mounting Type: SMD
R11 R12 = RES_100kΩ_0603_1%: as R9 on sheet Top; Supplier Part Number 1: 311-100KHRCT-ND; Supplier 1: Digi-Key
R13 = RES_16.5kΩ_0603_1%: RES 16.5K OHM 1% 1/10W 0603; Manufacturer 1: Yageo; Manufacturer Part Number 1: RC0603FR-0716K5L; Supplier 1: Digi-Key; Supplier Part Number 1: 311-16.5KHRCT-ND
R14 = RES_453kΩ_0603_1%: RES 453K OHM 1% 1/10W 0603; Manufacturer 1: Panasonic Electronic Components; Manufacturer Part Number 1: ERJ-3EKF4533V; Supplier Part Number 1: P453KHCT-ND; Supplier 1: Digi-Key; Mounting Type: SMD; Package: 0603
R16 = RES_1kΩ_0603_1%: RES 1K OHM 1% 1/8W 0603; Manufacturer 1: Stackpole Electronics Inc; Manufacturer Part Number 1: RNCP0603FTD1K00; Supplier Part Number 1: RNCP0603FTD1K00CT-ND; Supplier 1: Digi-Key; Mounting Type: SMD; Package: 0603
TP7 = TESTPOINT_1MM_CIRCLE: TESTPOINT 1MM CIRCLE
U3 = IC_COMPARATOR_MAX9020: IC COMPARATOR DUAL SOT23-8; Manufacturer 1: Analog Devices Inc./Maxim Integrated; Package/Footprint: SOT-23-8; Mounting Type: SMD; Supplier 1: Digi-Key; Supplier Part Number 1: MAX9020EKA+TCT-ND

## Sheet AP7387Q.SchDoc
size A4; Engineer: Farris Matar; Organization: TESLA Motors, INC; Address1: 3500 Deer Creek Road; Address2: Palo Alto, CA; Address4: U.S.A.; SheetNumber: 5; SheetTotal: 8
Used 2 times, as channels Power 3V3, Power 5V0. Parts and nets are listed once, with the designators drawn on the sheet.
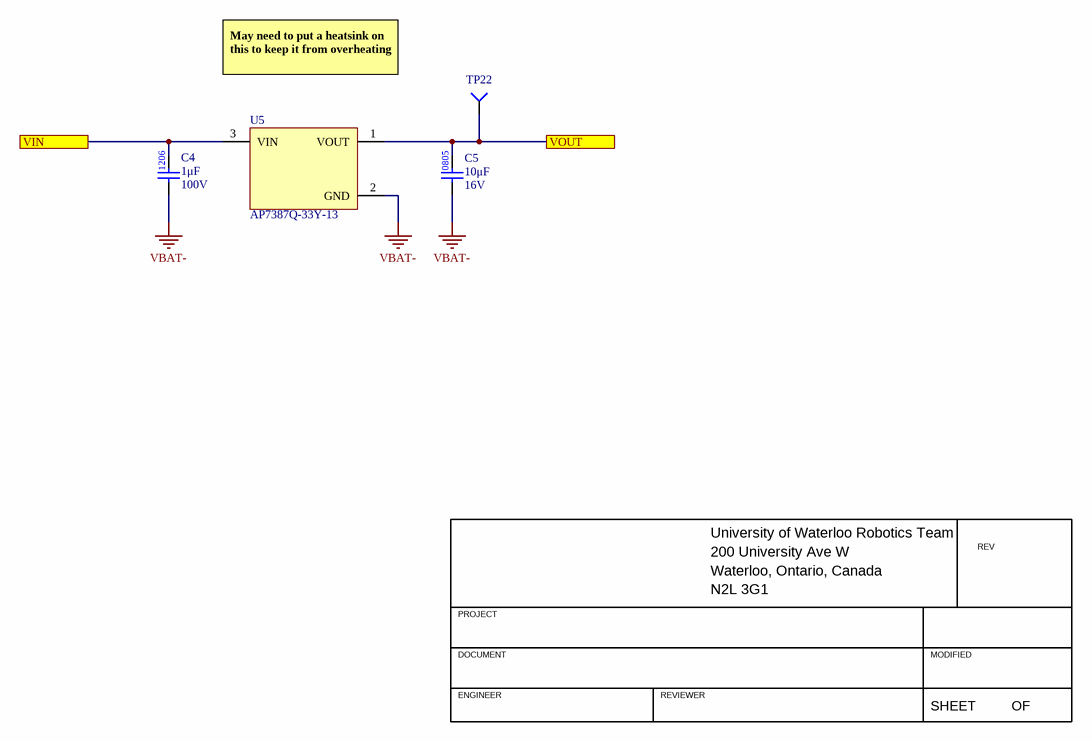
[diagram p4: AP7387Q.SchDoc]

### Parts
C4  value 1μF  Voltage Rating: 100V  [CAPC3216X190X50NL20T25]  (hidden comment: CAP_1uF_100V_1206)
C5  value 10μF  Voltage Rating: 16V  [CAP2012]  (hidden comment: CAP_10uF_16V_0805)
TP22  TESTPOINT_SMD_LOOP  [S1751-46R]  (value not drawn)
U5  Manufacturer Part Number 1: AP7387Q-33Y-13  [SOT89]  (hidden comment: LDO_3.3V_150mA_60VIN)

### Ports
VIN, VOUT

### Nets
VBAT-: C4.1 C5.1 U5.2(GND)
VIN: C4.2 U5.3(VIN) ; port VIN
VOUT: C5.2 TP22.1(=value) U5.1(VOUT) ; port VOUT

### Channels
Power 3V3: designators end in A; ports VIN=VBAT+ VOUT=3V3
Power 5V0: designators end in B; ports VIN=VBAT+ VOUT=5V0

### Notes on the sheet
- May need to put a heatsink on this to keep it from overheating
- University of Waterloo Robotics Team
- 200 University Ave W
- REV
- PROJECT
- Waterloo, Ontario, Canada
- N2L 3G1
- DOCUMENT
- ENGINEER
- REVIEWER
- MODIFIED
- SHEET
- OF

### Library data of the parts
C4 = CAP_1uF_100V_1206: CAP CER 1UF 100V X7R 1206; Supplier 1: Digi-Key; Mounting Type: SMD; Package: 1206; Supplier Part Number 1: 490-16468-1-ND
C5 = CAP_10uF_16V_0805: CAP CER 10UF 16V X5R 0805; Manufacturer 1: Yageo; Manufacturer Part Number 1: CC0805KKX5R7BB106; Package/Footprint: 0805; Mounting Type: SMD; Supplier 1: Digi-Key; Supplier Part Number 1: 311-1865-1-ND; Dielectric: X5R
TP22 = TESTPOINT_SMD_LOOP: as TP4 on sheet Top; Supplier 1: Digi-Key; Manufacturer Part Number 1: S1751-46R; Mounting Type: SMD; Package/Footprint: SMD; Supplier Part Number 1: 952-1478-1-ND
U5 = LDO_3.3V_150mA_60VIN: IC REG LINEAR 3.3V 150MA SOT89-3; Manufacturer 1: Diodes Incorporated; Current Output: 150mA; Supplier Part Number 1: 31-AP7387Q-33Y-13CT-ND; Supplier 1: Digi-Key

## Sheet Discharge_Load_Switch.SchDoc
size A4; Engineer: Farris Matar; Organization: TESLA Motors, INC; Address1: 3500 Deer Creek Road; Address2: Palo Alto, CA; Address4: U.S.A.; SheetNumber: 7; SheetTotal: 8
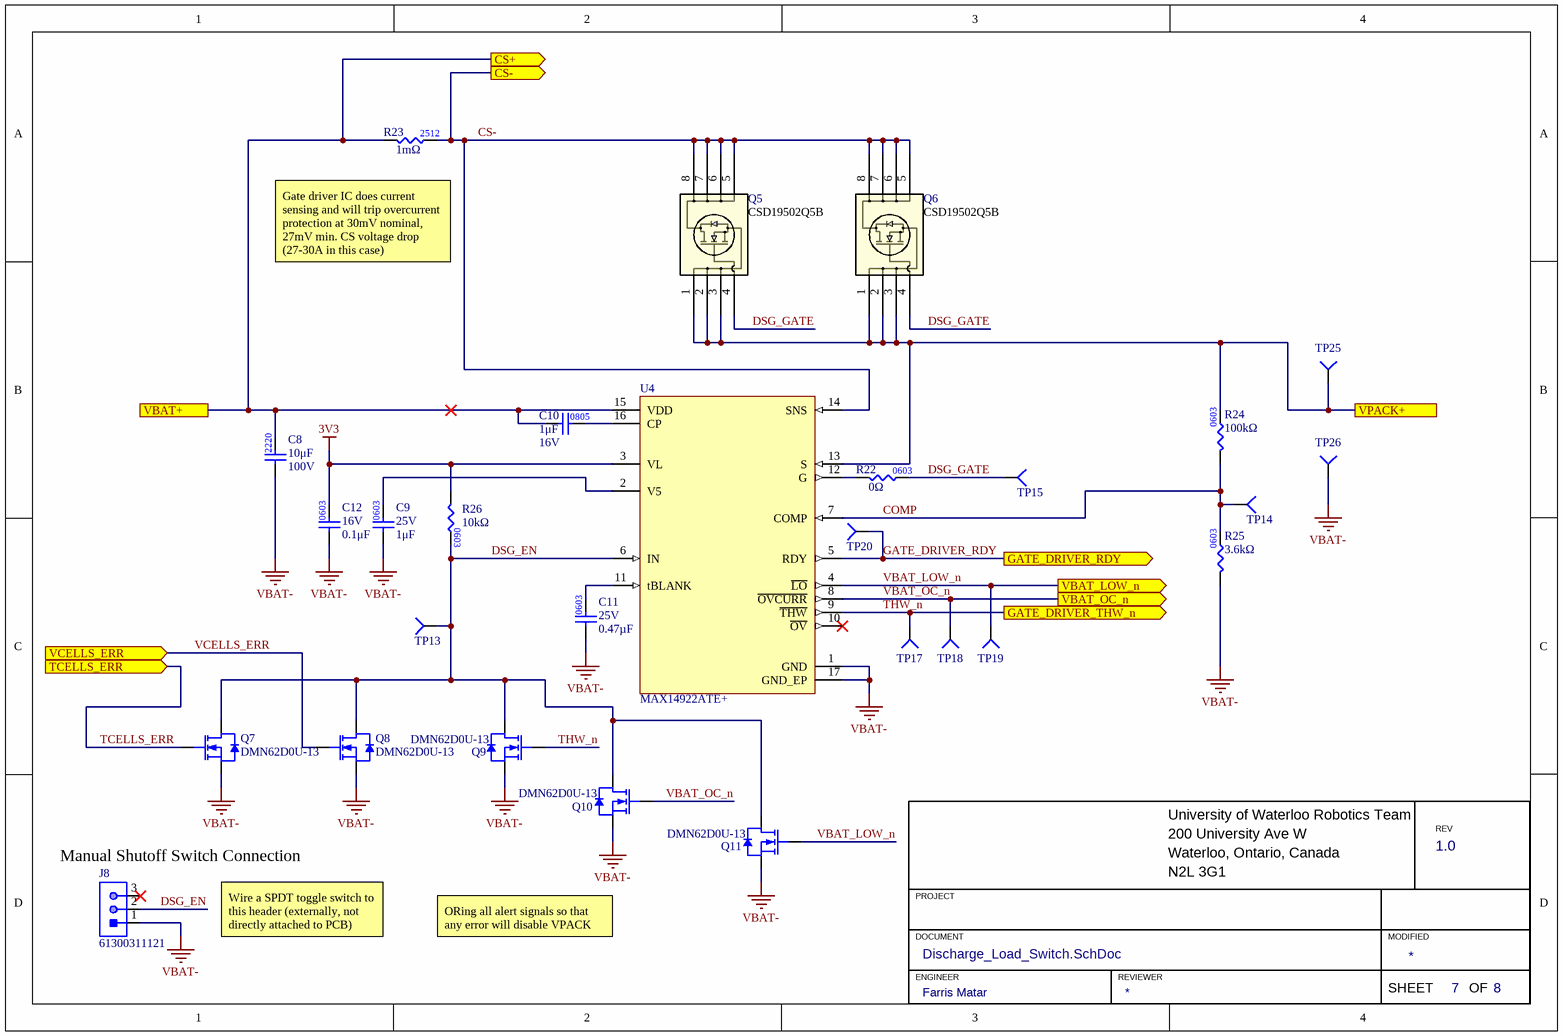
[diagram p5: Discharge_Load_Switch.SchDoc]

### Parts
C8  value 10μF  Voltage Rating: 100V  [CAP2220]  (hidden comment: CAP_10μF_100V_2220)
C9  value 1μF  Voltage Rating: 25V  [CAP0603]  (hidden comment: CAP_1uF_25V_0603)
C10  value 1μF  Voltage Rating: 16V  [CAP0805]  (hidden comment: CAP_1uF_16V_0805)
C11  value 0.47µF  Voltage Rating: 25V  [CAP0603]  (hidden comment: CAP_0.47uF_25V_0603)
C12  value 0.1μF  Voltage Rating: 16V  [CAP0603]  (hidden comment: CAP_0.1uF_16V_0603)
J8  Manufacturer Part Number 1: 61300311121  [HDR1X3]  (hidden comment: HEADER 3x1)
Q5  CSD19502Q5B  [DFN5060]
Q6  CSD19502Q5B  [DFN5060]
Q7  Manufacturer Part Number 1: DMN62D0U-13  [NMOS_SSOT-3]  (hidden comment: NMOS_60V_380mA)
Q8  Manufacturer Part Number 1: DMN62D0U-13  [NMOS_SSOT-3]  (hidden comment: NMOS_60V_380mA)
Q9  Manufacturer Part Number 1: DMN62D0U-13  [NMOS_SSOT-3]  (hidden comment: NMOS_60V_380mA)
Q10  Manufacturer Part Number 1: DMN62D0U-13  [NMOS_SSOT-3]  (hidden comment: NMOS_60V_380mA)
Q11  Manufacturer Part Number 1: DMN62D0U-13  [NMOS_SSOT-3]  (hidden comment: NMOS_60V_380mA)
R22  value 0Ω  [RES0603]  (hidden comment: RES_0Ω_0603)
R23  value 1mΩ  [RESC6532X75N]  (hidden comment: RES_1mΩ_2512_1%)
R24  value 100kΩ  [RES0603]  (hidden comment: RES_100kΩ_0603_1%)
R25  value 3.6kΩ  [RES0603]  (hidden comment: RES_3.6kΩ_0603_1%)
R26  value 10kΩ  [RES0603]  (hidden comment: RES_10kΩ_0603_1%)
TP13  TESTPOINT_1MM_CIRCLE  [TESTPOINT_CIRCLE_1MM]  (value not drawn)  (no BOM)
TP14  TESTPOINT_1MM_CIRCLE  [TESTPOINT_CIRCLE_1MM]  (value not drawn)  (no BOM)
TP15  TESTPOINT_1MM_CIRCLE  [TESTPOINT_CIRCLE_1MM]  (value not drawn)  (no BOM)
TP17  TESTPOINT_1MM_CIRCLE  [TESTPOINT_CIRCLE_1MM]  (value not drawn)  (no BOM)
TP18  TESTPOINT_1MM_CIRCLE  [TESTPOINT_CIRCLE_1MM]  (value not drawn)  (no BOM)
TP19  TESTPOINT_1MM_CIRCLE  [TESTPOINT_CIRCLE_1MM]  (value not drawn)  (no BOM)
TP20  TESTPOINT_1MM_CIRCLE  [TESTPOINT_CIRCLE_1MM]  (value not drawn)  (no BOM)
TP25  TESTPOINT_SMD_LOOP  [S1751-46R]  (value not drawn)
TP26  TESTPOINT_SMD_LOOP  [S1751-46R]  (value not drawn)
U4  MAX14922ATE+  [16-WFQFN MAXIM]

### Ports
CS+ (out), CS- (out), GATE_DRIVER_RDY (out), GATE_DRIVER_THW_n (out), TCELLS_ERR (in), VBAT+, VBAT_LOW_n (out), VBAT_OC_n (out), VCELLS_ERR (in), VPACK+

### Nets
3V3: C12.2 R26.1 U4.3(VL)
VBAT+: C8.2 C10.1 R23.1 U4.15(VDD) ; port VBAT+, port CS+
VBAT-: C8.1 C9.1 C11.1 C12.1 J8.1 Q7.2(SOURCE) Q8.2(SOURCE) Q9.2(SOURCE) Q10.2(SOURCE) Q11.2(SOURCE) R25.1 TP26.1(=value) U4.1(GND) U4.17(GND_EP)
VPACK+: Q5.1(S) Q5.2(S) Q5.3(S) Q6.1(S) Q6.2(S) Q6.3(S) R24.2 TP25.1(=value) U4.13(S) ; port VPACK+
COMP: R24.1 R25.2 TP14.1(=value) U4.7(COMP)
CS-: Q5.5(D) Q5.6(D) Q5.7(D) Q5.8(D) Q6.5(D) Q6.6(D) Q6.7(D) Q6.8(D) R23.2 U4.14(SNS) ; port CS-
DSG_EN: J8.2 Q7.3(DRAIN) Q8.3(DRAIN) Q9.3(DRAIN) Q10.3(DRAIN) Q11.3(DRAIN) R26.2 TP13.1(=value) U4.6(IN)
DSG_GATE: Q5.4(G) Q6.4(G) R22.2 TP15.1(=value)
GATE_DRIVER_RDY: TP20.1(=value) U4.5(RDY) ; port GATE_DRIVER_RDY
TCELLS_ERR: Q7.1(GATE) ; port TCELLS_ERR
THW_n: Q9.1(GATE) TP17.1(=value) U4.9(~{THW}) ; port GATE_DRIVER_THW_n  [project net GATE_DRIVER_THW_n]
VBAT_LOW_n: Q11.1(GATE) TP19.1(=value) U4.4(~{LO}) ; port VBAT_LOW_n
VBAT_OC_n: Q10.1(GATE) TP18.1(=value) U4.8(~{OVCURR}) ; port VBAT_OC_n
VCELLS_ERR: Q8.1(GATE) ; port VCELLS_ERR
NetC9_2: C9.2 U4.2(V5)
NetC10_2: C10.2 U4.16(CP)
NetC11_2: C11.2 U4.11(tBLANK)
NetR22_1: R22.1 U4.12(G)

Not connected (* = marked no-connect by the designer): J8 3*; U4 10(~{OV})*

### Notes on the sheet
- (near R23) Gate driver IC does current sensing and will trip overcurrent protection at 30mV nominal, 27mV min. CS voltage drop (27-30A in this case)
- (near J8) Manual Shutoff Switch Connection
- University of Waterloo Robotics Team
- 200 University Ave W
- REV
- PROJECT
- Waterloo, Ontario, Canada
- N2L 3G1
- Wire a SPDT toggle switch to this header (externally, not directly attached to PCB)
- ORing all alert signals so that any error will disable VPACK
- DOCUMENT
- ENGINEER
- REVIEWER
- MODIFIED
- SHEET
- OF
- (in symbol RES_100kΩ_0603_1%) 0603

### Library data of the parts
C8 = CAP_10μF_100V_2220: CAP CER 10UF 100V X7S 2220; Manufacturer 1: TDK Corporation; Manufacturer Part Number 1: CGA9N3X7S2A106K230KE; Mounting Type: SMD; Package: 2220; Supplier 1: Digi-Key; Supplier Part Number 1: 445-8768-1-ND
C9 = CAP_1uF_25V_0603: CAP CER 1UF 25V X5R 0603; Manufacturer 1: Samsung; Manufacturer Part Number 1: CL10A105KA8NNNC; Supplier 1: Digi-Key; Mounting Type: SMD; Package: 0603; Supplier Part Number 1: 1276-1102-1-ND; Dielectric: X5R
C10 = CAP_1uF_16V_0805: CAP CER 1UF 16V X7R 0805; Manufacturer 1: Yageo; Manufacturer Part Number 1: CC0805KKX7R7BB105; Mounting Type: SMD; Supplier 1: Digi-Key; Supplier Part Number 1: 311-1365-1-ND; Package: 0805; Dielectric: X7R
C11 = CAP_0.47uF_25V_0603: CAP CER 0.47UF 25V X7R 0603; Manufacturer 1: KEMET; Manufacturer Part Number 1: C0603C474K3RAC7867; Package: 0603; Supplier 1: Digi-Key; Supplier Part Number 1: 399-11934-1-ND
C12 = CAP_0.1uF_16V_0603: CAP CER 0.1UF 16V X7R 0603; Manufacturer Part Number 1: CC0603KRX7R7BB104; Manufacturer 1: Yageo; Package: 0603; Supplier Part Number 1: 311-1088-1-ND; Supplier 1: Digi-Key; Dielectric: X7R
J8 = HEADER 3x1: CONN HEADER VERT 3POS 2.54MM; Manufacturer 1: Würth Elektronik; Supplier 1: Digi-Key; Mounting Type: TH; Pitch: 2.54mm; Supplier Part Number 1: 732-5316-ND
Q5 Q6 = NMOS_CSD19502Q5B_80V_100A: MOSFET N-CH 80V 100A 8VSON; Manufacturer 1: Texas Instruments; Vgs (Max): ±20V; Package/Footprint: 8-PowerTDFN; Vdss (Max): 80V; Id: 100A; Supplier 1: Digi-Key; Supplier Part Number 1: 296-37194-1-ND; Manufacturer Part Number 1: CSD19502Q5B
Q7-Q11 = NMOS_60V_380mA: as Q2 on sheet Cell_Volt_Comparator; Supplier 1: Digi-Key; Mounting Type: SMD; Package: SOT-23-3; Supplier Part Number 1: DMN62D0U-13DICT-ND; Id: 380mA; Vdss: 60V
R22 = RES_0Ω_0603: RES 0 OHM JUMPER 1/10W 0603; Manufacturer 1: Yageo; Manufacturer Part Number 1: RC0603JR-070RL; Supplier Part Number 1: 311-0.0GRCT-ND; Supplier 1: Digi-Key; Mounting Type: SMD; Package: 0603
R23 = RES_1mΩ_2512_1%: RES 1 mOHM 1% 3W 2512; Manufacturer 1: Riedon; Manufacturer Part Number 1: CSRL3-0R001F8; Supplier 1: Digi-Key; Supplier Part Number 1: 696-1834-1-ND; Mounting Type: SMD; Package: 2512
R24 = RES_100kΩ_0603_1%: as R9 on sheet Top; Supplier Part Number 1: 311-100KHRCT-ND; Supplier 1: Digi-Key
R25 = RES_3.6kΩ_0603_1%: RES 3.6K OHM 1% 1/10W 0603; Manufacturer 1: Yageo; Manufacturer Part Number 1: RC0603FR-073K6L; Mounting Type: SMD; Package: 0603; Supplier 1: Digi-Key; Supplier Part Number 1: 311-3.60KHRCT-ND
R26 = RES_10kΩ_0603_1%: RES 10K OHM 1% 1/8W 0603; Manufacturer 1: Stackpole Electronics Inc; Manufacturer Part Number 1: RNCP0603FTD10K0; Supplier Part Number 1: RNCP0603FTD10K0CT-ND; Supplier 1: Digi-Key; Mounting Type: SMD; Package: 0603
TP13-TP15 TP17-TP20 = TESTPOINT_1MM_CIRCLE: TESTPOINT 1MM CIRCLE
TP25 TP26 = TESTPOINT_SMD_LOOP: as TP4 on sheet Top; Supplier 1: Digi-Key; Manufacturer Part Number 1: S1751-46R; Mounting Type: SMD; Package/Footprint: SMD; Supplier Part Number 1: 952-1478-1-ND
U4 = MAX14922ATE+: HIGH-SIDE SWITCH CONTROLLER; Manufacturer 1: Analog Devices Inc./Maxim Integrated; Package/Footprint: 16-WFQFN; Manufacturer Part Number 1: MAX14922ATE+; Supplier 1: Mouser; Supplier Part Number 1: 700-MAX14922ATE+T

## Sheet Logic_Inverter.SchDoc
size A4; Engineer: Farris Matar; Organization: TESLA Motors, INC; Address1: 3500 Deer Creek Road; Address2: Palo Alto, CA; Address4: U.S.A.; SheetNumber: 6; SheetTotal: 8
Used 2 times, as channels Inverter B, Inverter A. Parts and nets are listed once, with the designators drawn on the sheet.
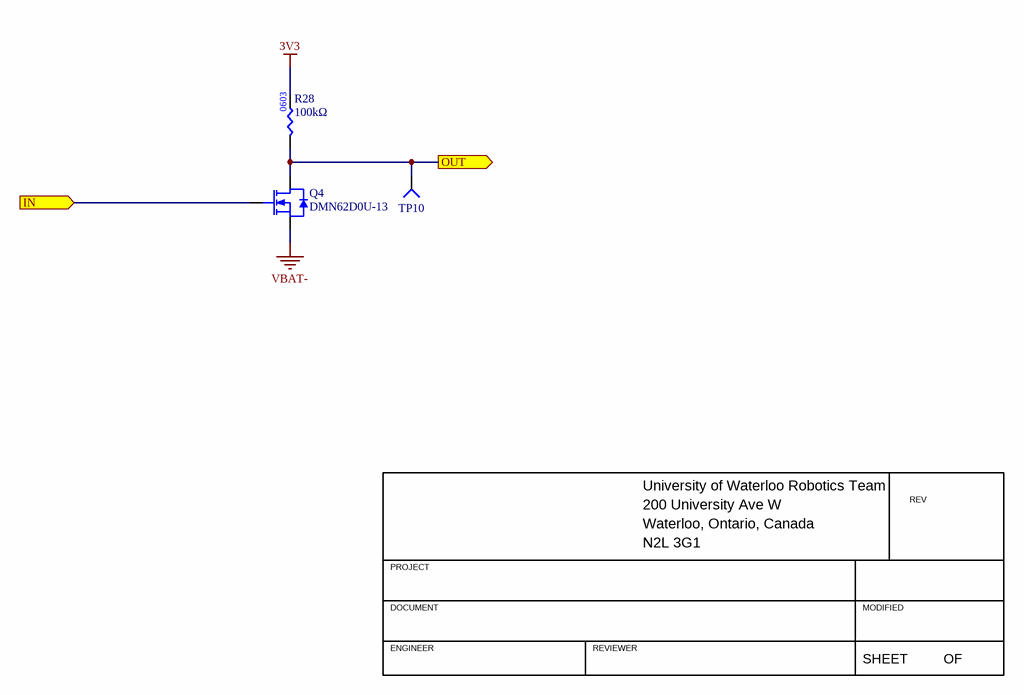
[diagram p6: Logic_Inverter.SchDoc]

### Parts
Q4  Manufacturer Part Number 1: DMN62D0U-13  [NMOS_SSOT-3]  (hidden comment: NMOS_60V_380mA)
R28  value 100kΩ  [RES0603]  (hidden comment: RES_100kΩ_0603_1%)
TP10  TESTPOINT_1MM_CIRCLE  [TESTPOINT_CIRCLE_1MM]  (value not drawn)  (no BOM)

### Ports
IN (in), OUT (out)

### Nets
3V3: R28.2
VBAT-: Q4.2(SOURCE)
IN: Q4.1(GATE) ; port IN
OUT: Q4.3(DRAIN) R28.1 TP10.1(=value) ; port OUT

### Channels
Inverter B: designators end in A; ports IN=CT_GD OUT=TCELLS_ERR
Inverter A: designators end in B; ports IN=VCELLS_GOOD OUT=VCELLS_ERR

### Notes on the sheet
- University of Waterloo Robotics Team
- 200 University Ave W
- REV
- PROJECT
- Waterloo, Ontario, Canada
- N2L 3G1
- DOCUMENT
- ENGINEER
- REVIEWER
- MODIFIED
- SHEET
- OF
- (in symbol RES_100kΩ_0603_1%) 0603

### Library data of the parts
Q4 = NMOS_60V_380mA: as Q2 on sheet Cell_Volt_Comparator; Supplier 1: Digi-Key; Mounting Type: SMD; Package: SOT-23-3; Supplier Part Number 1: DMN62D0U-13DICT-ND; Id: 380mA; Vdss: 60V
R28 = RES_100kΩ_0603_1%: as R9 on sheet Top; Supplier Part Number 1: 311-100KHRCT-ND; Supplier 1: Digi-Key
TP10 = TESTPOINT_1MM_CIRCLE: TESTPOINT 1MM CIRCLE

## Sheet MAX9919.SchDoc
size A4; SheetNumber: 8; SheetTotal: 8
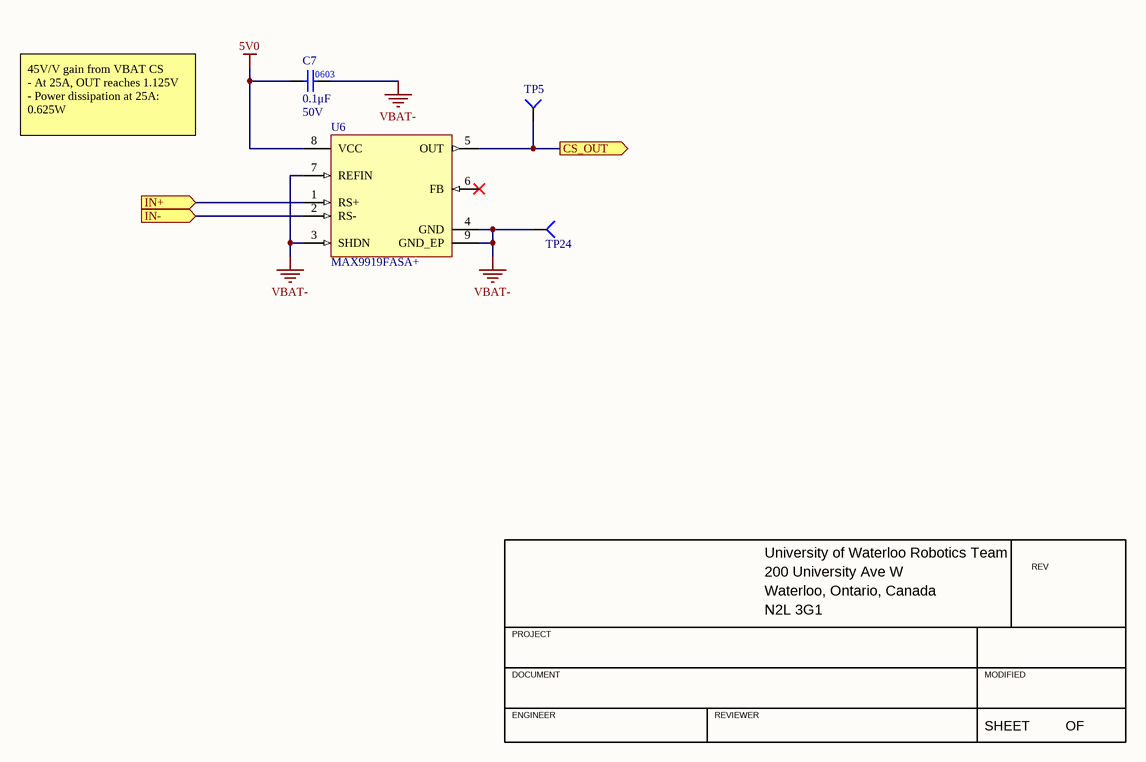
[diagram p7: MAX9919.SchDoc]

### Parts
C7  value 0.1μF  Voltage Rating: 50V  [CAP0603]  (hidden comment: CAP_0.1uF_50V_0603)
TP5  TESTPOINT_1MM_CIRCLE  [TESTPOINT_CIRCLE_1MM]  (value not drawn)  (no BOM)
TP24  TESTPOINT_SMD_LOOP  [S1751-46R]  (value not drawn)
U6  MAX9919FASA+  [8-SOIC_MAXIM_S8E+14]

### Ports
CS_OUT (out), IN+ (in), IN- (in)

### Nets
5V0: C7.1 U6.8(VCC)
VBAT+: U6.1(RS+) ; port IN+
VBAT-: C7.2 TP24.1(=value) U6.3(SHDN) U6.4(GND) U6.7(REFIN) U6.9(GND_EP)
CS-: U6.2(RS-) ; port IN-
DSG_CS: TP5.1(=value) U6.5(OUT) ; port CS_OUT

Not connected (* = marked no-connect by the designer): U6 6(FB)*

### Notes on the sheet
- 45V/V gain from VBAT CS
  - At 25A, OUT reaches 1.125V
  - Power dissipation at 25A: 0.625W
- University of Waterloo Robotics Team
- 200 University Ave W
- REV
- PROJECT
- Waterloo, Ontario, Canada
- N2L 3G1
- DOCUMENT
- ENGINEER
- REVIEWER
- MODIFIED
- SHEET
- OF

### Library data of the parts
C7 = CAP_0.1uF_50V_0603: CAP CER 0.1UF 50V X7R 0603; Manufacturer 1: Yageo; Manufacturer Part Number 1: CC0603KRX7R9BB104; Package/Footprint: 0603; Supplier 1: Digi-Key; Supplier Part Number 1: 311-1344-1-ND; Mounting Type: SMD; Dielectric: X7R
TP5 = TESTPOINT_1MM_CIRCLE: TESTPOINT 1MM CIRCLE
TP24 = TESTPOINT_SMD_LOOP: as TP4 on sheet Top; Supplier 1: Digi-Key; Manufacturer Part Number 1: S1751-46R; Mounting Type: SMD; Package/Footprint: SMD; Supplier Part Number 1: 952-1478-1-ND
U6 = MAX9919FASA+: IC CURRENT SENSE 1 CIRCUIT 8SOIC; Manufacturer 1: Analog Devices Inc./Maxim Integrated; Package/Footprint: 8-SOIC; Supplier 1: Digi-Key; Supplier Part Number 1: MAX9919FASA+-ND; Manufacturer Part Number 1: MAX9919FASA+

## Nets that join several sheets
3V3: Top (R9.2 R15.2 R27.2), Cell Voltage Comparator1 (R6A.2), Cell Voltage Comparator2 (R6B.2), Cell Voltage Comparator3 (R6C.2), Cell Voltage Comparator4 (R6D.2), Cell Voltage Comparator5 (R6E.2), Cell Voltage Comparator6 (R6F.2), Cell Voltage Comparator7 (R6G.2), Cell Voltage Comparator8 (R6H.2), Cell Voltage Comparator9 (R6I.2), Cell Voltage Comparator10 (R6J.2), Cell Voltage Comparator11 (R6K.2), Cell Voltage Comparator12 (R6L.2), Cell Voltage Comparator13 (R6M.2), Cell Voltage Comparator14 (R6N.2), Cell Voltage Comparator15 (R6O.2), Cell Voltage Comparator16 (R6P.2), Battery Temperature Comparator1 (6 pins), Battery Temperature Comparator2 (6 pins), Battery Temperature Comparator3 (6 pins), Battery Temperature Comparator4 (6 pins), Power 3V3 (C5A.2 TP22A.1 U5A.1), Discharge_Load_Switch (C12.2 R26.1 U4.3), Inverter B (R28A.2), Inverter A (R28B.2)
5V0: MAX9919 (C7.1 U6.8), Power 5V0 (C5B.2 TP22B.1 U5B.1)
VBAT+: Battery_Interface (F1.2 R21.2 TP2.1), Power 3V3 (C4A.2 U5A.3), Discharge_Load_Switch (C8.2 C10.1 R23.1 U4.15), MAX9919 (U6.1), Power 5V0 (C4B.2 U5B.3)
VBAT-: Top (8 pins), Cell Voltage Comparator1 (Q2A.2 S2A.2 U2A.3), Cell Voltage Comparator2 (Q2B.2 S2B.2 U2B.3), Cell Voltage Comparator3 (Q2C.2 S2C.2 U2C.3), Cell Voltage Comparator4 (Q2D.2 S2D.2 U2D.3), Cell Voltage Comparator5 (Q2E.2 S2E.2 U2E.3), Cell Voltage Comparator6 (Q2F.2 S2F.2 U2F.3), Cell Voltage Comparator7 (Q2G.2 S2G.2 U2G.3), Cell Voltage Comparator8 (Q2H.2 S2H.2 U2H.3), Cell Voltage Comparator9 (Q2I.2 S2I.2 U2I.3), Cell Voltage Comparator10 (Q2J.2 S2J.2 U2J.3), Cell Voltage Comparator11 (Q2K.2 S2K.2 U2K.3), Cell Voltage Comparator12 (Q2L.2 S2L.2 U2L.3), Cell Voltage Comparator13 (Q2M.2 S2M.2 U2M.3), Cell Voltage Comparator14 (Q2N.2 S2N.2 U2N.3), Cell Voltage Comparator15 (Q2O.2 S2O.2 U2O.3), Cell Voltage Comparator16 (Q2P.2 S2P.2 U2P.3), Battery_Interface (J1.2 R29.1 TP1.1), Battery Temperature Comparator1 (6 pins), Battery Temperature Comparator2 (6 pins), Battery Temperature Comparator3 (6 pins), Battery Temperature Comparator4 (6 pins), Power 3V3 (C4A.1 C5A.1 U5A.2), Discharge_Load_Switch (14 pins), Inverter B (Q4A.2), Inverter A (Q4B.2), MAX9919 (6 pins), Power 5V0 (C4B.1 C5B.1 U5B.2)
VPACK+: Top (J2.1), Discharge_Load_Switch (9 pins)
CS-: Discharge_Load_Switch (10 pins), MAX9919 (U6.2)
CT_GD: Top (J6.2 R15.1 TP8.1), Battery Temperature Comparator1 (Q3A.1 U3A.1 U3A.7), Battery Temperature Comparator2 (Q3B.1 U3B.1 U3B.7), Battery Temperature Comparator3 (Q3C.1 U3C.1 U3C.7), Battery Temperature Comparator4 (Q3D.1 U3D.1 U3D.7), Inverter B (Q4A.1)
DSG_CS: Top (J6.9), MAX9919 (TP5.1 U6.5)
GATE_DRIVER_RDY: Top (J6.11 R27.1), Discharge_Load_Switch (TP20.1 U4.5)
GATE_DRIVER_THW_n: Top (J6.4), Discharge_Load_Switch (Q9.1 TP17.1 U4.9)
TCELLS_ERR: Discharge_Load_Switch (Q7.1), Inverter B (Q4A.3 R28A.1 TP10A.1)
VBAT_FB: Top (J6.13), Battery_Interface (R21.1 R29.2 TP6.1)
VBAT_LOW_n: Top (J6.6), Discharge_Load_Switch (Q11.1 TP19.1 U4.4)
VBAT_OC_n: Top (J6.7), Discharge_Load_Switch (Q10.1 TP18.1 U4.8)
VCELLS_ERR: Discharge_Load_Switch (Q8.1), Inverter A (Q4B.3 R28B.1 TP10B.1)
VCELLS_GOOD: Top (J6.1 R9.1 TP9.1), Cell Voltage Comparator1 (Q2A.3), Cell Voltage Comparator2 (Q2B.3), Cell Voltage Comparator3 (Q2C.3), Cell Voltage Comparator4 (Q2D.3), Cell Voltage Comparator5 (Q2E.3), Cell Voltage Comparator6 (Q2F.3), Cell Voltage Comparator7 (Q2G.3), Cell Voltage Comparator8 (Q2H.3), Cell Voltage Comparator9 (Q2I.3), Cell Voltage Comparator10 (Q2J.3), Cell Voltage Comparator11 (Q2K.3), Cell Voltage Comparator12 (Q2L.3), Cell Voltage Comparator13 (Q2M.3), Cell Voltage Comparator14 (Q2N.3), Cell Voltage Comparator15 (Q2O.3), Cell Voltage Comparator16 (Q2P.3), Inverter A (Q4B.1)

## Assembly variants
BUILD: alternate parts C2P -> CAP_0.1uF_100V_0805, C2M -> CAP_0.1uF_100V_0805, C2N -> CAP_0.1uF_100V_0805, C2O -> CAP_0.1uF_100V_0805, U5B -> LDO_5V_150mA_60VIN